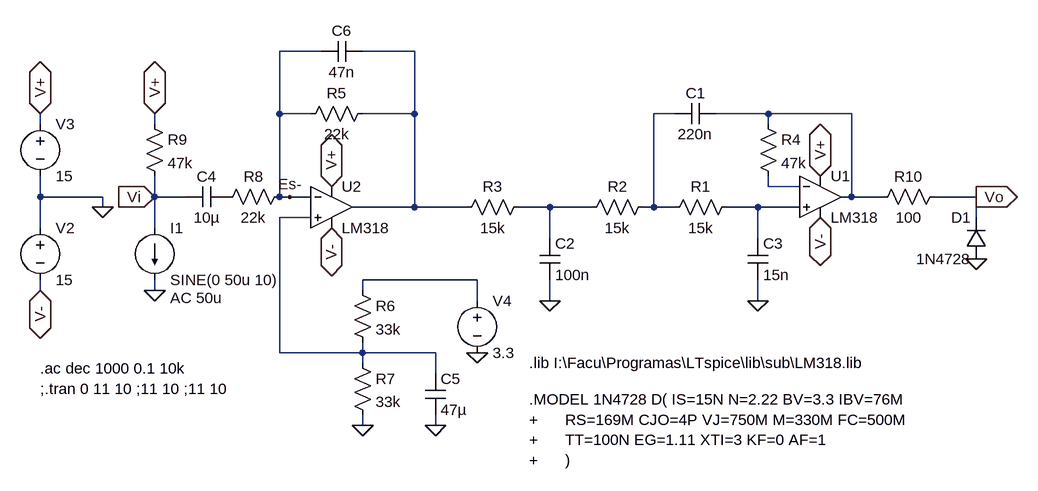
[diagram p0: schematic Filtro Anti-Aliasing.asc]
Filtro Anti-Aliasing.asc, the LTspice schematic file:
Version 4
SHEET 1 1968 680
WIRE 176 -176 112 -176
WIRE 320 -176 240 -176
WIRE 112 -80 112 -176
WIRE 160 -80 112 -80
WIRE 320 -80 320 -176
WIRE 320 -80 240 -80
WIRE 720 -80 688 -80
WIRE 864 -80 784 -80
WIRE 992 -80 864 -80
WIRE -256 -64 -256 -80
WIRE -80 -64 -80 -80
WIRE 864 -64 864 -80
WIRE 864 32 864 16
WIRE 912 32 864 32
WIRE -256 48 -256 16
WIRE -160 48 -256 48
WIRE -80 48 -80 16
WIRE -32 48 -80 48
WIRE 112 48 112 -80
WIRE 128 48 112 48
WIRE 160 48 128 48
WIRE 992 48 992 -80
WIRE 992 48 976 48
WIRE 1040 48 992 48
WIRE 1184 48 1120 48
WIRE -160 64 -160 48
WIRE 320 64 320 -80
WIRE 320 64 224 64
WIRE 400 64 320 64
WIRE 528 64 480 64
WIRE 592 64 528 64
WIRE 688 64 688 -80
WIRE 688 64 672 64
WIRE 720 64 688 64
WIRE 848 64 800 64
WIRE 912 64 848 64
WIRE 160 80 112 80
WIRE 1184 80 1184 48
WIRE -256 96 -256 48
WIRE -80 96 -80 48
WIRE 528 112 528 64
WIRE 848 112 848 64
WIRE 416 176 240 176
WIRE -256 192 -256 176
WIRE -80 192 -80 176
WIRE 240 192 240 176
WIRE 416 208 416 176
WIRE 528 208 528 176
WIRE 848 208 848 176
WIRE 112 288 112 80
WIRE 240 288 240 272
WIRE 240 288 112 288
WIRE 352 288 240 288
WIRE 240 304 240 288
WIRE 352 320 352 288
WIRE 240 400 240 384
WIRE 352 400 352 384
FLAG -80 192 0
FLAG 528 208 0
FLAG 848 208 0
FLAG -160 64 0
FLAG -256 -80 V+
IOPIN -256 -80 BiDir
FLAG 944 16 V+
IOPIN 944 16 BiDir
FLAG -256 192 V-
IOPIN -256 192 BiDir
FLAG 944 80 V-
IOPIN 944 80 BiDir
FLAG -80 48 Vi
IOPIN -80 48 In
FLAG 1184 48 Vo
IOPIN 1184 48 Out
FLAG 240 400 0
FLAG 192 32 V+
IOPIN 192 32 BiDir
FLAG 192 96 V-
IOPIN 192 96 BiDir
FLAG 352 400 0
FLAG 416 288 0
FLAG 128 48 Es-
FLAG -80 -80 V+
IOPIN -80 -80 BiDir
FLAG 1184 144 0
SYMBOL cap 512 112 R0
SYMATTR InstName C2
SYMATTR Value 100n
SYMBOL cap 832 112 R0
SYMATTR InstName C3
SYMATTR Value 15n
SYMBOL res 496 48 R90
WINDOW 0 0 56 VBottom 2
WINDOW 3 32 56 VTop 2
SYMATTR InstName R3
SYMATTR Value 15k
SYMBOL res 688 48 R90
WINDOW 0 0 56 VBottom 2
WINDOW 3 32 56 VTop 2
SYMATTR InstName R2
SYMATTR Value 15k
SYMBOL res 816 48 R90
WINDOW 0 0 56 VBottom 2
WINDOW 3 32 56 VTop 2
SYMATTR InstName R1
SYMATTR Value 15k
SYMBOL cap 784 -96 R90
WINDOW 0 0 32 VBottom 2
WINDOW 3 32 32 VTop 2
SYMATTR InstName C1
SYMATTR Value 220n
SYMBOL Opamps\\opamp2 944 -16 R0
SYMATTR InstName U1
SYMATTR Value LM318
SYMBOL voltage -256 80 R0
WINDOW 123 0 0 Left 0
WINDOW 39 0 0 Left 0
SYMATTR InstName V2
SYMATTR Value 15
SYMBOL voltage -256 -80 R0
WINDOW 123 0 0 Left 0
WINDOW 39 0 0 Left 0
SYMATTR InstName V3
SYMATTR Value 15
SYMBOL Opamps\\opamp2 192 0 R0
SYMATTR InstName U2
SYMATTR Value LM318
SYMBOL res 256 -96 R90
WINDOW 0 0 56 VBottom 2
WINDOW 3 32 56 VTop 2
SYMATTR InstName R5
SYMATTR Value 22k
SYMBOL res 224 176 R0
SYMATTR InstName R6
SYMATTR Value 33k
SYMBOL res 224 288 R0
SYMATTR InstName R7
SYMATTR Value 33k
SYMBOL cap 32 32 R90
WINDOW 0 0 32 VBottom 2
WINDOW 3 32 32 VTop 2
SYMATTR InstName C4
SYMATTR Value 10µ
SYMBOL cap 336 320 R0
SYMATTR InstName C5
SYMATTR Value 47µ
SYMBOL voltage 416 192 R0
WINDOW 123 0 0 Left 0
WINDOW 39 0 0 Left 0
SYMATTR InstName V4
SYMATTR Value 3.3
SYMBOL res 848 -80 R0
SYMATTR InstName R4
SYMATTR Value 47k
SYMBOL res 128 32 R90
WINDOW 0 0 56 VBottom 2
WINDOW 3 32 56 VTop 2
SYMATTR InstName R8
SYMATTR Value 22k
SYMBOL current -80 96 R0
WINDOW 123 24 108 Left 2
WINDOW 39 0 0 Left 0
SYMATTR Value2 AC 50u
SYMATTR InstName I1
SYMATTR Value SINE(0 50u 10)
SYMBOL res -96 -80 R0
SYMATTR InstName R9
SYMATTR Value 47k
SYMBOL cap 240 -192 R90
WINDOW 0 0 32 VBottom 2
WINDOW 3 32 32 VTop 2
SYMATTR InstName C6
SYMATTR Value 47n
SYMBOL res 1136 32 R90
WINDOW 0 0 56 VBottom 2
WINDOW 3 32 56 VTop 2
SYMATTR InstName R10
SYMATTR Value 100
SYMBOL diode 1200 144 R180
WINDOW 0 24 64 Left 2
WINDOW 3 24 0 Left 2
SYMATTR InstName D1
SYMATTR Value 1N4728
TEXT -256 312 Left 2 !.ac dec 1000 0.1 10k
TEXT -256 344 Left 2 !;.tran 0 11 10 ;11 10 ;11 10
TEXT 496 304 Left 2 !.lib I:\\Facu\\Programas\\LTspice\\lib\\sub\\LM318.lib
TEXT 496 360 Left 2 !.MODEL 1N4728 D( IS=15N N=2.22 BV=3.3 IBV=76M \n+      RS=169M CJO=4P VJ=750M M=330M FC=500M \n+      TT=100N EG=1.11 XTI=3 KF=0 AF=1 \n+      )

The netlist it stands for:
* Filtro Anti-Aliasing.asc
C2 N005 0 100n
C3 N006 0 15n
R3 N005 N001 15k
R2 N002 N005 15k
R1 N006 N002 15k
C1 N003 N002 220n
XU1 N006 N004 V+ V- N003 LM318  ; pins In+ In- V+ V- OUT
V2 0 V- 15
V3 V+ 0 15
XU2 N007 Es- V+ V- N001 LM318  ; pins In+ In- V+ V- OUT
R5 N001 Es- 22k
R6 N008 N007 33k
R7 N007 0 33k
C4 P001 Vi 10µ
C5 N007 0 47µ
V4 N008 0 3.3
R4 N003 N004 47k
R8 Es- P001 22k
I1 Vi 0 SINE(0 50u 10) AC 50u
R9 V+ Vi 47k
C6 N001 Es- 47n
R10 Vo N003 100
D1 0 Vo 1N4728
.model D D
.lib standard.dio
.ac dec 1000 0.1 10k
;.tran 0 11 10 ;11 10 ;11 10
.lib I:\Facu\Programas\LTspice\lib\sub\LM318.lib
.MODEL 1N4728 D( IS=15N N=2.22 BV=3.3 IBV=76M
+      RS=169M CJO=4P VJ=750M M=330M FC=500M
+      TT=100N EG=1.11 XTI=3 KF=0 AF=1
+      )
.backanno
.end